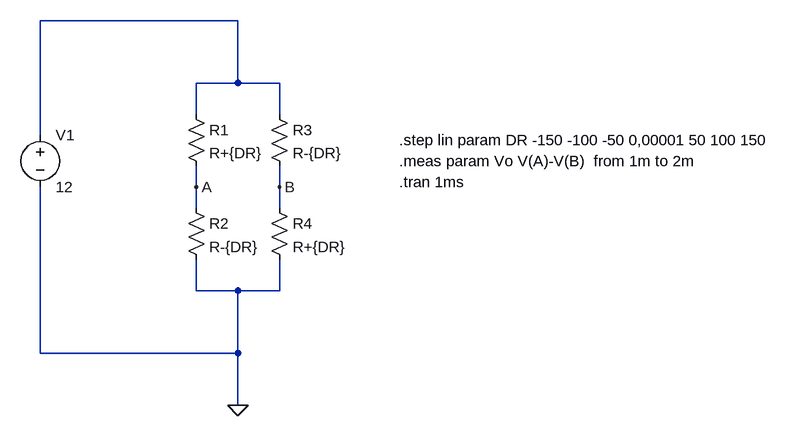
[diagram p0: schematic FULL BRIDGE.asc]
FULL BRIDGE.asc, the LTspice schematic file:
Version 4.1
SHEET 1 1036 680
WIRE 160 -64 -144 -64
WIRE 160 32 160 -64
WIRE 160 32 96 32
WIRE 224 32 160 32
WIRE 96 80 96 32
WIRE 224 80 224 32
WIRE -144 112 -144 -64
WIRE 96 192 96 160
WIRE 224 192 224 160
WIRE 96 224 96 192
WIRE 224 224 224 192
WIRE 96 352 96 304
WIRE 160 352 96 352
WIRE 224 352 224 304
WIRE 224 352 160 352
WIRE -144 448 -144 192
WIRE 160 448 160 352
WIRE 160 448 -144 448
WIRE 160 528 160 448
FLAG 96 192 A
FLAG 224 192 B
FLAG 160 528 0
SYMBOL res 80 64 R0
SYMATTR InstName R1
SYMATTR Value R+{DR}
SYMBOL res 80 208 R0
SYMATTR InstName R2
SYMATTR Value R-{DR}
SYMBOL res 208 64 R0
SYMATTR InstName R3
SYMATTR Value R-{DR}
SYMBOL res 208 208 R0
SYMATTR InstName R4
SYMATTR Value R+{DR}
SYMBOL voltage -144 96 R0
WINDOW 123 0 0 Left 0
WINDOW 39 0 0 Left 0
SYMATTR InstName V1
SYMATTR Value 12
TEXT 408 120 Left 2 !.step lin param DR -150 -100 -50 0,00001 50 100 150
TEXT 408 152 Left 2 !.meas param Vo V(A)-V(B)  from 1m to 2m
TEXT 408 184 Left 2 !.tran 1ms

The netlist it stands for:
* FULL BRIDGE.asc
R1 N001 A R+{DR}
R2 A 0 R-{DR}
R3 N001 B R-{DR}
R4 B 0 R+{DR}
V1 N001 0 12
.step lin param DR -150 -100 -50 0,00001 50 100 150
.meas param Vo V(A)-V(B)  from 1m to 2m
.tran 1ms
.backanno
.end